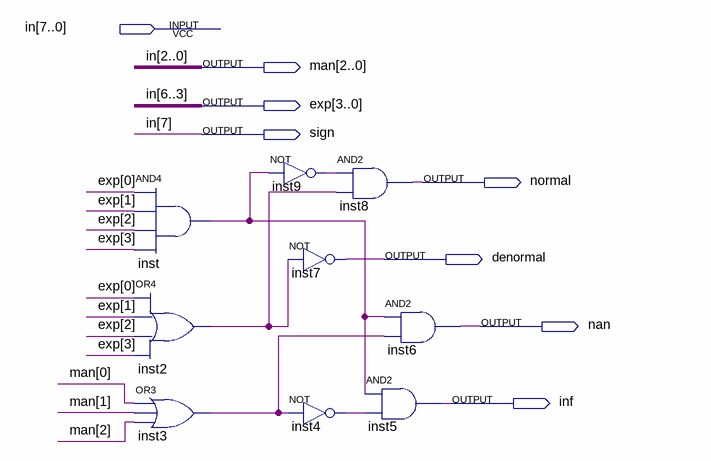
[diagram p0: schematic sheet]
// Quartus schematic fp_separator.bdf as structural Verilog: 9 symbols, 8 pins
module fp_separator (
  input  [7:0] in,
  output [2:0] man,
  output [3:0] exp,
  output sign,
  output normal,
  output denormal,
  output nan,
  output inf
);

  wire inst2_out, inst3_out, inst4_out, inst9_out, inst_out;

  and inst (inst_out, in[3], in[4], in[5], in[6]);
  or inst2 (inst2_out, in[3], in[4], in[5], in[6]);
  or inst3 (inst3_out, in[0], in[1], in[2]);
  not inst9 (inst9_out, inst_out);
  and inst8 (normal, inst9_out, inst2_out);
  not inst7 (denormal, inst2_out);
  not inst4 (inst4_out, inst3_out);
  and inst6 (nan, inst_out, inst3_out);
  and inst5 (inf, inst_out, inst4_out);

  assign exp = in[6:3];
  assign man = in[2:0];
  assign sign = in[7];
endmodule
